# EAGLE design explore (EAGLE 9.1.1)
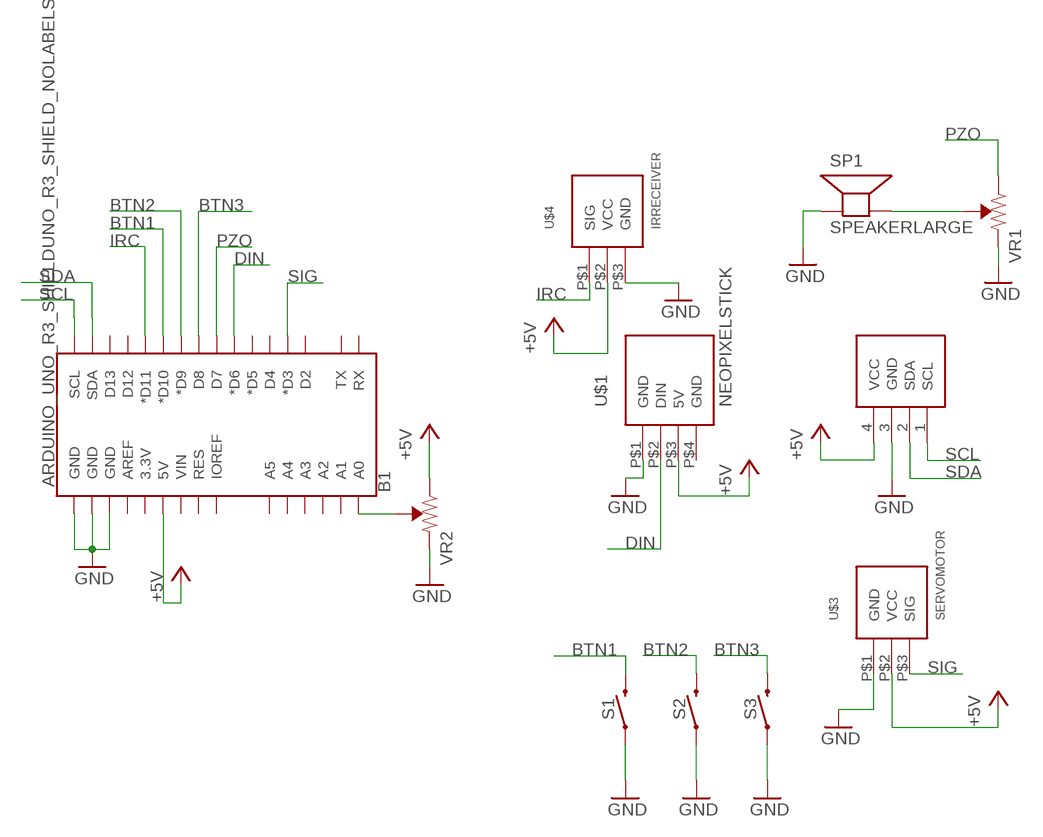
[diagram p0: schematic, sheet 1]

## Parts
B1  ARDUINO_UNO_R3_SHIELDUNO_R3_SHIELD_NOLABELS_LOCK  [UNO_R3_SHIELD_NOLABELS_LOCK]
S1  MOMENTARY-SWITCH-SPST-PTH-6.0MM  [TACTILE_SWITCH_PTH_6.0MM]
S2  MOMENTARY-SWITCH-SPST-PTH-6.0MM  [TACTILE_SWITCH_PTH_6.0MM]
S3  MOMENTARY-SWITCH-SPST-PTH-6.0MM  [TACTILE_SWITCH_PTH_6.0MM]
SP1  SPEAKERLARGE  [2-HOLE_LARGE]
U$1  NEOPIXELSTICK  [NEOPIXELSTICK]
U$2  4DIGITDISPLAYOUTLINE  [4DIGITDISPLAY]
U$3  SERVOMOTOR  [3-HOLE-LARGE]
U$4  IRRECEIVER  [3-HOLE-LARGE]
VR1  TRIMPOTSTANDARD  [POTENTIOMETER]
VR2  TRIMPOTSTANDARD  [POTENTIOMETER]

## Nets
+5V: B1.5V U$1.P$3(5V) U$2.4(VCC) U$3.P$2(VCC) U$4.P$2(VCC) VR2.P$3(CW)
BTN1: B1.D10(*D10) S1.3
BTN2: B1.D9(*D9) S2.3
BTN3: B1.D8 S3.3
DIN: B1.D6(*D6) U$1.P$2(DIN)
GND: B1.GND@0(GND) B1.GND@1(GND) B1.GND@2(GND) S1.1 S2.1 S3.1 SP1.P$1(+) U$1.P$1(GND) U$2.3(GND) U$3.P$1(GND) U$4.P$3(GND) VR1.P$1(CCW) VR2.P$1(CCW)
IRC: B1.D11(*D11) U$4.P$1(SIG)
N$1: B1.A0 VR2.P$2(WIPER)
N$2: SP1.P$2(-) VR1.P$2(WIPER)
PZO: B1.D7 VR1.P$3(CW)
SCL: B1.SCL U$2.1(SCL)
SDA: B1.SDA U$2.2(SDA)
SIG: B1.D3(*D3) U$3.P$3(SIG)
Unconnected: B1.3.3V B1.A1 B1.A2 B1.A3 B1.A4 B1.A5 B1.AREF B1.D2 B1.D4 B1.D5(*D5) B1.D12 B1.D13 B1.IOREF B1.RES B1.RX B1.TX B1.VIN U$1.P$4(GND)

## Library data of the parts
B1 = christy:ARDUINO_UNO_R3_SHIELD: Arduino R3 Shield Footprint Shield form compatible with the Arduino Uno R3. SparkFun Products: MG2639 Cellular Shield <https://www.sparkfun.com/products/13120> MIDI Shield <https://www.sparkfun.com/products/12898> R3 Stackable Headers Kit <https://www.sparkfun.com/products/11417>
S1-S3 = SparkFun-Switches:MOMENTARY-SWITCH-SPST: Momentary Switch (Pushbutton) - SPST Normally-open (NO) SPST momentary switches (buttons, pushbuttons). Variants PTH-12MM - 12mm square, through-hole Momentary Pushbutton Switch - 12mm Square <https://www.sparkfun.com/products/9190> (COM-09190) PTH-6.0MM, PTH-6.0MM-KIT - 6.0mm square, through-hole Mini Pushbutton Switch <https://www.sparkfun.com/products/97> (COM-00097) KIT package intended for soldering kit's - only one side of pads' copper is exposed. PTH-RIGHT-ANGLE-KIT - Right-angle, through-hole Right Angle Tactile Button <https://www.sparkfun.com/products/10791> - Used on SparkFun BigTime Watch Kit <https://www.sparkfun.com/products/11734> SMD-12MM - 12mm square, surface-mount Tactile Button - SMD (12mm) <https://www.sparkfun.com/products/12993> (COM-12993) Used on SparkFun PicoBoard <https://www.sparkfun.com/products/11888> SMD-4.5MM - 4.5mm Square Trackball Switch Used on SparkFun Blackberry Trackballer Breakout <https://www.sparkfun.com/products/13169> SMD-4.6MMX2.8MM - 4.60mm x 2.80mm, surface mount Used on SparkFun SAMD21 Mini Breakout <https://www.sparkfun.com/products/13664> SMD-5.2MM, SMD-5.2-REDUNDANT - 5.2mm square, surface-mount Mini Pushbutton Switch - SMD <https://www.sparkfun.com/products/8720> (COM-08720) Used on Arduino Pro Mini <https://www.sparkfun.com/products/11114> REDUNDANT package connects both switch circuits together SMD-6.0X3.5MM - 6.0 x 3.5mm, surface mount Momentary Reset Switch SMD <https://www.sparkfun.com/products/8229> (COM-08229) SMD-6.2MM-TALL - 6.2mm square, surface mount Tactile Button - SMD (6mm) <https://www.sparkfun.com/products/12992> Used on SparkFun Digital Sandbox <https://www.sparkfun.com/products/12651> SMD-RIGHT-ANGLE - Right-angle, surface mount Used on SparkFun Block for Intel® Edison - Arduino <https://www.sparkfun.com/products/13036>; PROD_ID: SWCH-08441; SF_SKU: COM-00097
SP1 = christy:SPEAKER: SPEAKER Source: Buerklin Added PS12 (for part # PS1240 piezo) http://www.ladyada.net/library/pcb/eaglelibrary.html
U$1 = christy:NEOPIXELSTICK
U$2 = christy:4DIGITDISPLAY
U$3 = christy:SERVOMOTOR
U$4 = christy:IRRECEIVER
VR1 VR2 = christy:TRIMPOT: Trimming Potentiometer (Trimpot) Three-terminal potentiometers, with an adjustable wiper and two adjustable resistors. A pot can be used to create a configurable voltage divider, or as a variable resistor. "Trimpots" are a subset of potentiometers, usually intended for "set-and-forget" applications. They're often more delicate than standard potentiometers - rated for fewer turns. Variants PTH-KNOB - PTH Trimpot w/ finger-adjustable knob Trimpot 10K with Knob <https://www.sparkfun.com/products/9806> (COM-09806) Datasheet <http://www.sparkfun.com/datasheets/Components/General/TSR-3386.pdf> SMD-3MM-CLOSED-FRAME - SMD 3mm Square Closed-Frame Trimpot Used on e.g. EasyDriver - Stepper Motor Driver <https://www.sparkfun.com/products/12779> Datasheet <http://www.bitechnologies.com/pdfs/22.pdf> (22AR10KTR) SMD-5MM - SMD 5mm Square Closed-Frame Trimpot Used on e.g. IOIO-OTG - V2.2 <https://www.sparkfun.com/products/13613> Datasheet <http://www.vishay.com/docs/51008/ts53.pdf> (TS53YL502MR10) SMD-3MM-1/10W-25% - 3mm Square Open-Frame Trimpot Used on e.g. SparkFun Shapeoko <https://www.sparkfun.com/products/13899> Datasheet <http://www.bourns.com/docs/Product-Datasheets/TC33.pdf> (TC33X-2-103E)

## Net classes
0 default: width 0.457 mm, drill 0.457 mm, clearance 0.457 mm

## Board
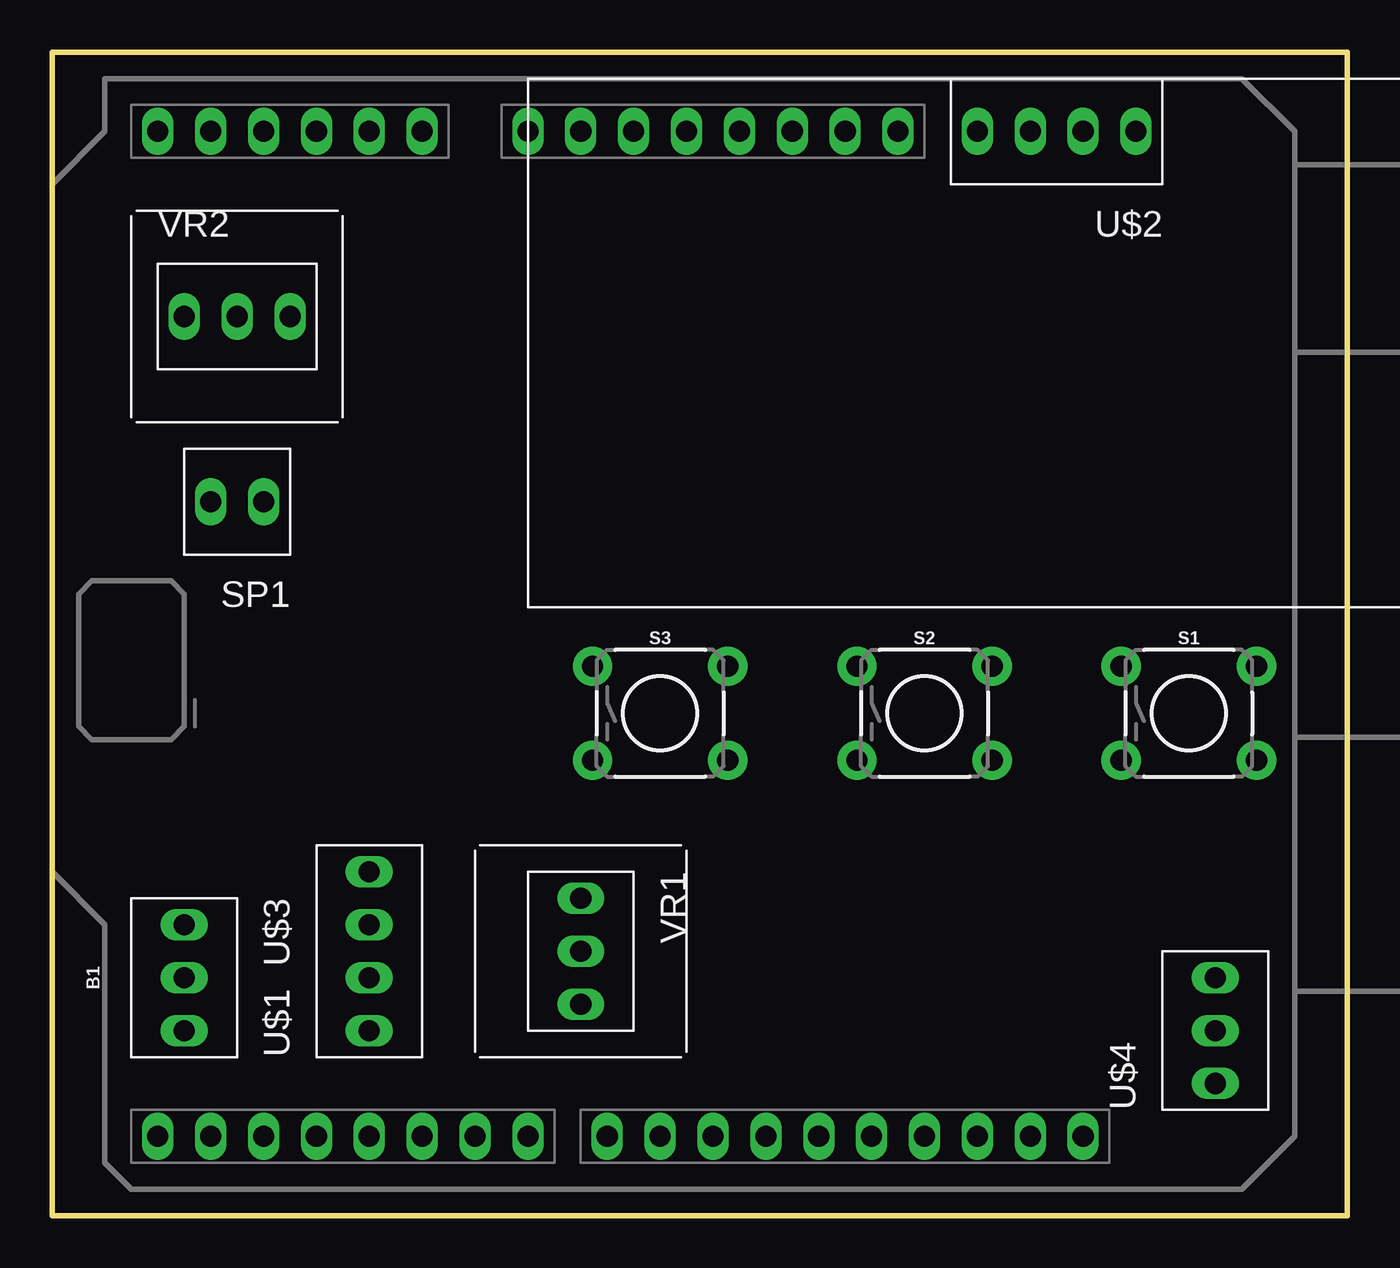
[diagram p1: board, top side]
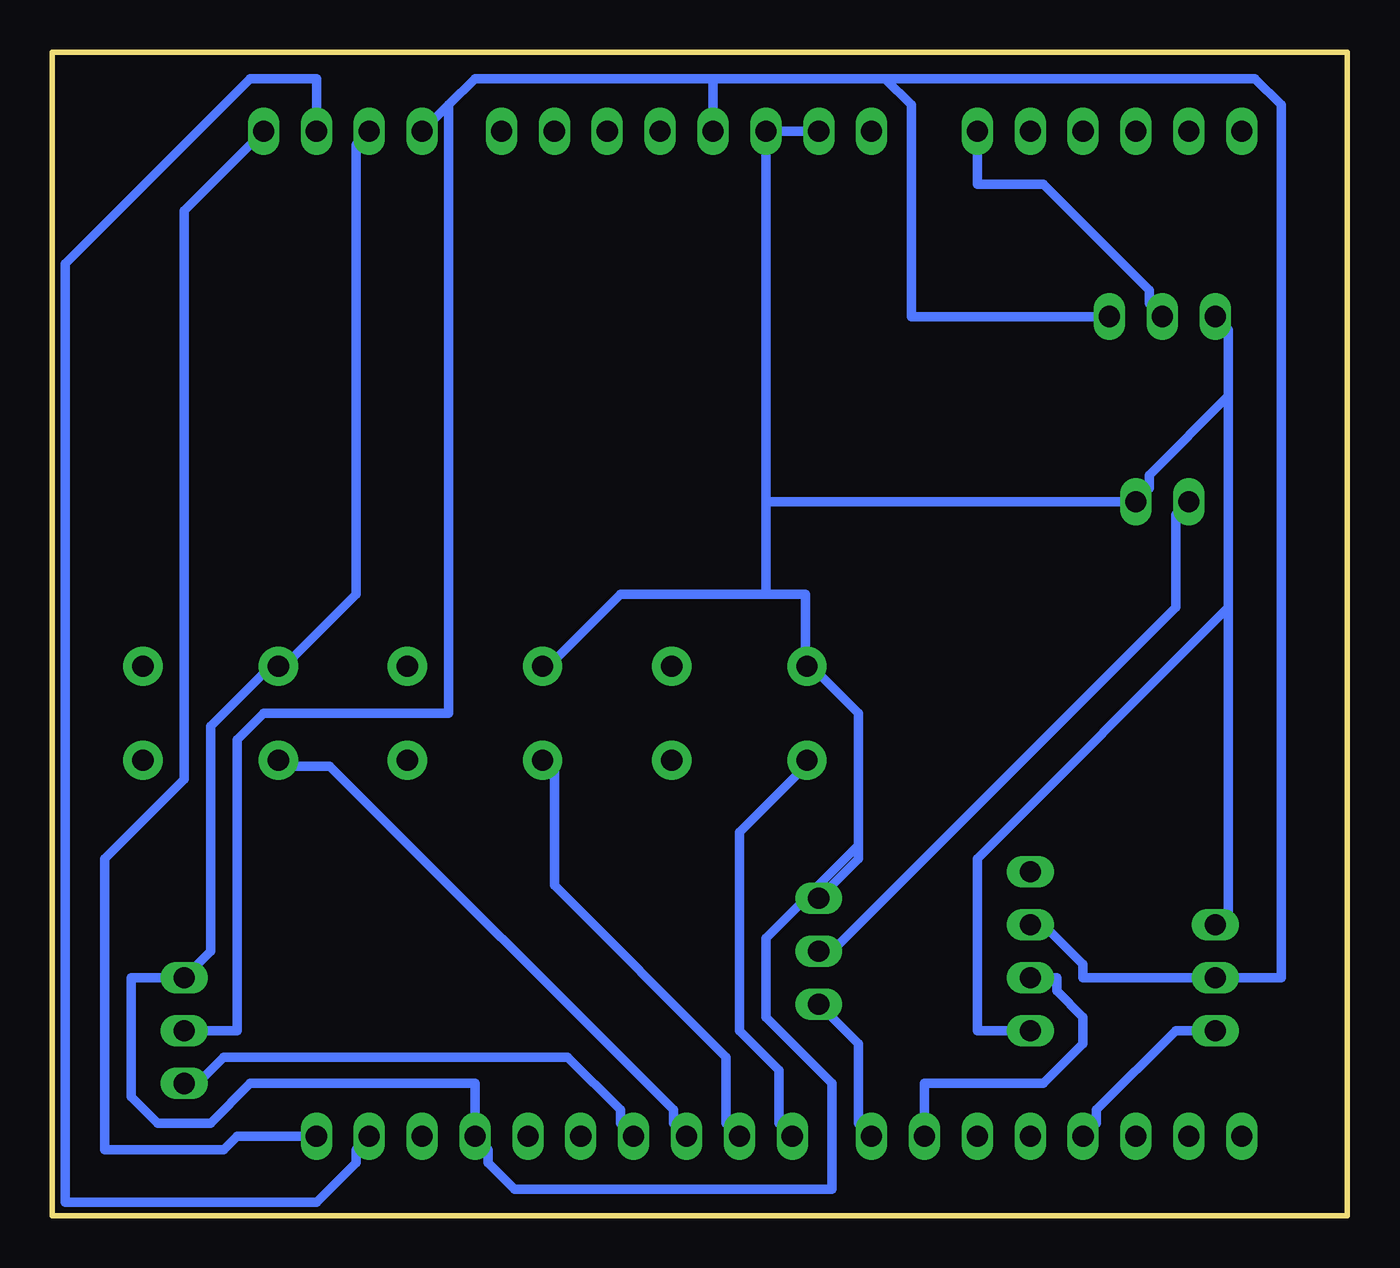
[diagram p2: board, bottom side, seen from below]

Size 62.23 x 55.88 mm. Coordinates in mm from the lower left corner, seen from the top.
Outline: 0,0 0,55.88 62.23,55.88 62.23,0 0,0
Copper layers (1*16): Top 0.035mm / dielectric 1.5mm / Bottom 0.035mm
Design rules "OthermillDRC_1_32_v2": minimum track width 8mil, minimum drill 0.8mm, track to track 0.794003125mm, track to pad 0.794003125mm, pad to pad 0.794003125mm, via to via 0.794003125mm, smd to smd 0mil, copper to edge 0mil, drill to drill 1mil, minimum pad ring 10mil, minimum via ring 10mil, stop-mask expansion 1mil, vias tented up to drill 30mil, thermal gap 10mil

### Footprints (pad centres in the part's own frame; a part is rotated, then mirrored left to right if it is on the bottom)
UNO_R3_SHIELD_NOLABELS_LOCK = drill 1.016 long: 3.3V -7.62,44.45; 5V -10.16,44.45; A0 -22.86,44.45; A1 -25.4,44.45; A2 -27.94,44.45; A3 -30.48,44.45; A4 -33.02,44.45; A5 -35.56,44.45; AREF 3.81,-3.81; D2 -30.48,-3.81; D3 -27.94,-3.81; D4 -25.4,-3.81; D5 -22.86,-3.81; D6 -20.32,-3.81; D7 -17.78,-3.81; D8 -13.97,-3.81; D9 -11.43,-3.81; D10 -8.89,-3.81; D11 -6.35,-3.81; D12 -3.81,-3.81; D13 -1.27,-3.81; GND@0 -12.7,44.45; GND@1 -15.24,44.45; GND@2 1.27,-3.81; IOREF -2.54,44.45; NC 0,44.45; RES -5.08,44.45; RX -35.56,-3.81; SCL 8.89,-3.81; SDA 6.35,-3.81; TX -33.02,-3.81; VIN -17.78,44.45
TACTILE_SWITCH_PTH_6.0MM = drill 1.016 pad 1.88: 1 -3.251,2.261; 2 3.251,2.261; 3 -3.251,-2.261; 4 3.251,-2.261
2-HOLE_LARGE = drill 1.016 long: P$1 -1.27,0; P$2 1.27,0
NEOPIXELSTICK = drill 1.016 long: P$1 -3.81,0; P$2 -1.27,0; P$3 1.27,0; P$4 3.81,0
4DIGITDISPLAY = drill 1.016 long: 1 -3.81,0; 2 -1.27,0; 3 1.27,0; 4 3.81,0
3-HOLE-LARGE = drill 1.016 long: P$1 -2.54,0; P$2 0,0; P$3 2.54,0
POTENTIOMETER = drill 1.016 long: P$1 -2.54,0; P$2 0,0; P$3 2.54,0

### Placement (x,y rotation side)
B1  40.64,7.62 0 top
S1  54.61,24.13 0 top
S2  41.91,24.13 0 top
S3  29.21,24.13 0 top
SP1  8.89,34.29 180 top
U$1  15.24,12.7 90 top
U$2  48.26,52.07 180 top
U$3  6.35,11.43 270 top
U$4  55.88,8.89 90 top
VR1  25.4,12.7 270 top
VR2  8.89,43.18 0 top

### Tracks (layer width: path | path; a pad name or v marks a point on that pad's centre or on a via)
+5V
  Bottom 0.457: U$1.P$3 14.61,13.97 12.7,12.06 12.7,11.43 U$3.P$2 3.17,11.43 3.17,53.34 4.45,54.61 22.23,54.61 | VR2.P$3 20.95,43.18 20.95,53.34 22.23,54.61 | 30.48,54.61 22.23,54.61 | B1.5V 30.48,54.61 | 43.18,53.34 41.91,54.61 30.48,54.61 | 43.18,53.34 U$2.4 | U$4.P$2 53.34,8.89 53.34,22.86 52.07,24.13 43.18,24.13 43.18,53.34
BTN1
  Bottom 0.457: B1.D10 32.38,4.45 32.38,5.08 48.9,21.59 50.8,21.59 S1.3
BTN2
  Bottom 0.457: B1.D9 29.84,4.45 29.84,7.62 38.1,15.88 38.1,21.59 S2.3
BTN3
  Bottom 0.457: B1.D8 27.3,4.45 27.3,6.98 29.21,8.89 29.21,18.41 26.04,21.59 S3.3
DIN
  Bottom 0.457: U$1.P$2 13.97,11.43 13.97,10.79 12.7,9.53 12.7,8.26 14.61,6.35 20.32,6.35 B1.D6
GND
  Bottom 0.457: U$2.3 47.62,51.44 47.62,29.84 50.8,26.67 S1.1 51.44,26.67 54.61,23.5 54.61,12.7 U$4.P$3 58.42,11.43 58.42,5.71 57.15,4.45 54.61,4.45 52.7,6.35 41.91,6.35 B1.GND@2 41.27,3.17 41.27,2.54 40.01,1.27 24.77,1.27 24.77,6.35 27.94,9.53 27.94,13.33 23.5,17.78 | U$3.P$1 5.71,14.61 5.71,29.21 | 5.71,39.37 5.71,42.55 VR2.P$1 | 5.71,39.37 5.71,29.21 | U$1.P$1 17.78,8.89 17.78,17.14 5.71,29.21 | 5.71,39.37 9.53,35.56 9.53,34.93 SP1.P$1 27.94,34.29 | B1.GND@1 B1.GND@0 27.94,34.29 | VR1.P$1 23.5,17.14 23.5,17.78 | 23.5,17.78 23.5,24.13 25.4,26.04 S3.1 26.04,26.67 26.04,29.84 27.94,29.84 | 27.94,29.84 34.92,29.84 38.1,26.67 S2.1 | 27.94,29.84 27.94,34.29
IRC
  Bottom 0.457: B1.D11 34.92,4.45 34.92,5.08 37.47,7.62 53.98,7.62 55.24,6.35 U$4.P$1
N$1
  Bottom 0.457: VR2.P$2 9.53,43.82 9.53,44.45 14.61,49.53 17.78,49.53 B1.A0
N$2
  Bottom 0.457: SP1.P$2 8.26,33.66 8.26,29.21 24.77,12.7 VR1.P$2
PZO
  Bottom 0.457: B1.D7 23.5,4.45 23.5,8.26 VR1.P$3
SCL
  Bottom 0.457: B1.SCL 53.34,3.81 53.98,3.17 59.69,3.17 59.69,17.14 55.88,20.95 55.88,48.26 U$2.1
SDA
  Bottom 0.457: B1.SDA 47.62,3.17 47.62,2.54 49.53,0.64 61.59,0.64 61.59,45.72 52.7,54.61 49.53,54.61 U$2.2
SIG
  Bottom 0.457: B1.D3 12.06,4.45 12.06,5.08 8.26,8.89 U$3.P$3